# Altium schematic sheet FPGA_NonIO.SchDoc: User FPGA Pwr and Programming
size A3; Organization: Altium Limited.; Address1: Level 3, 12a Rodborough Rd; Address2: Frenchs Forest 2086; Address3: NSW; Address4: AUSTRALIA; DocumentNumber: 8; SheetNumber: 9; SheetTotal: 78
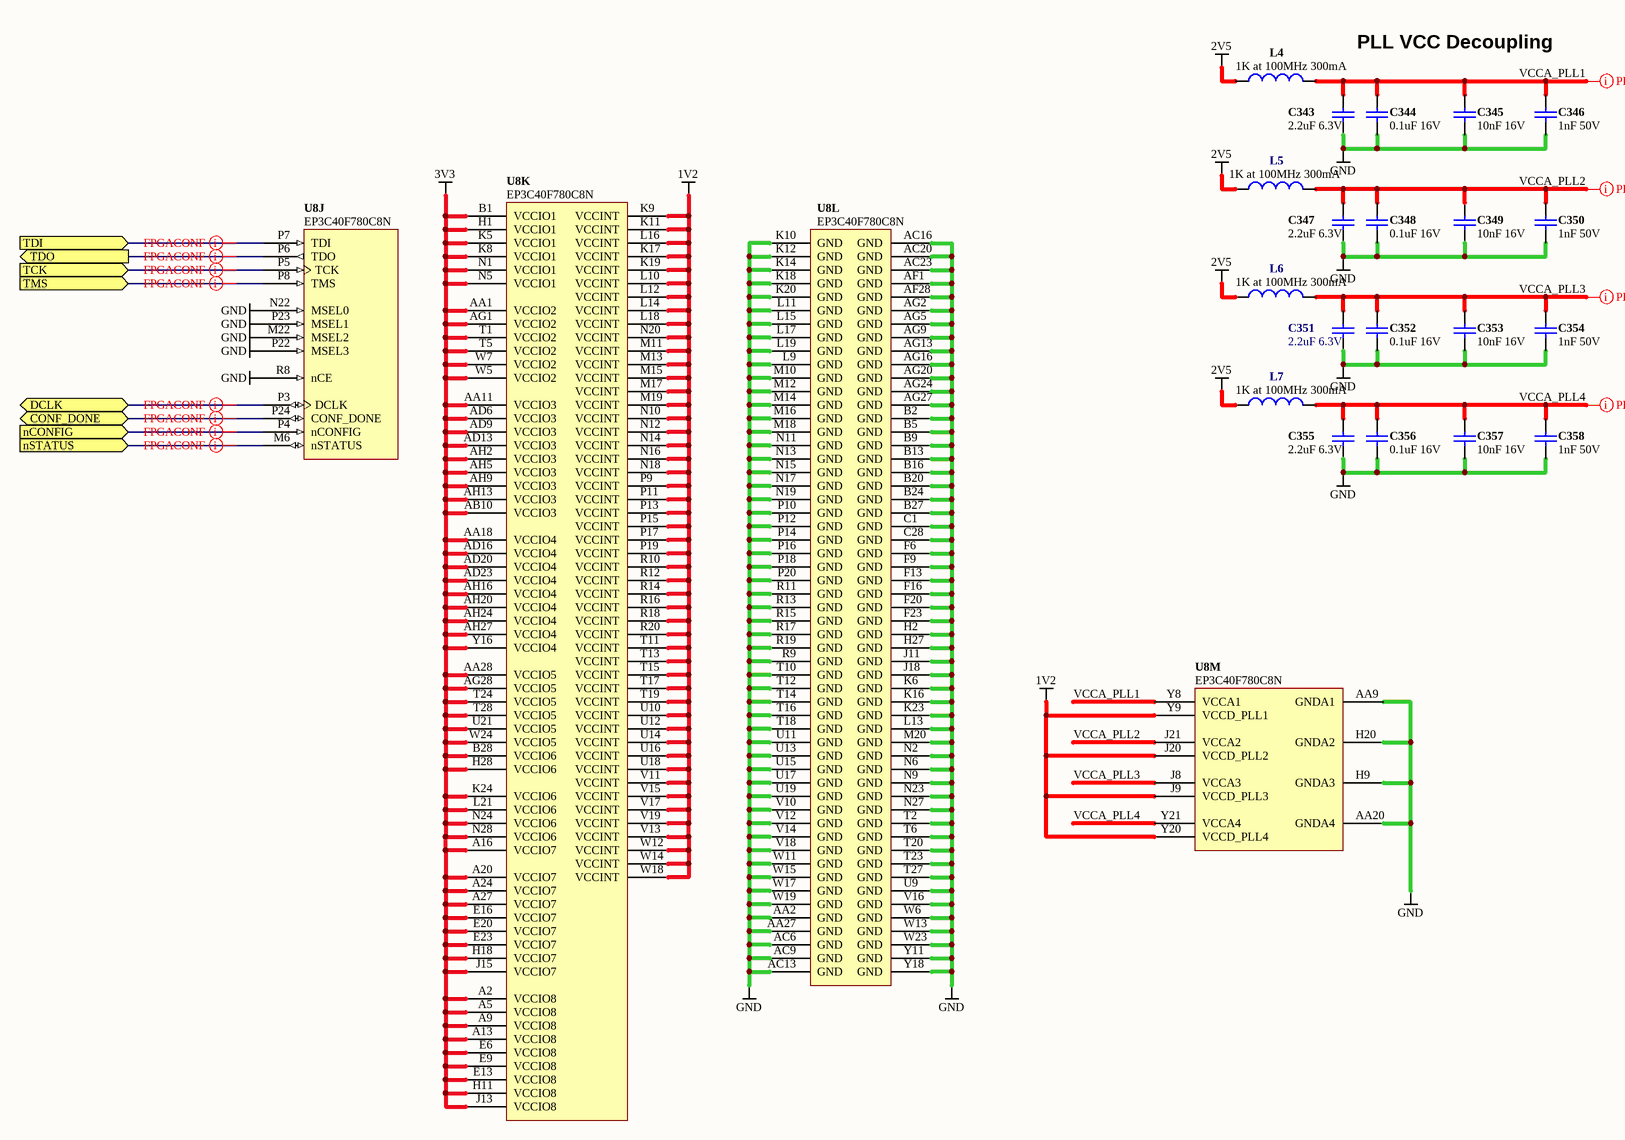
[diagram p0: FPGA_NonIO.SchDoc]

## Parts
C343  2.2uF 6.3V  [CAPC1005-STAR]
C344  0.1uF 16V  [CAPC1005-STAR]
C345  10nF 16V  [CAPC1005-STAR]
C346  1nF 50V  [CAPC1005-STAR]
C347  2.2uF 6.3V  [CAPC1005-STAR]
C348  0.1uF 16V  [CAPC1005-STAR]
C349  10nF 16V  [CAPC1005-STAR]
C350  1nF 50V  [CAPC1005-STAR]
C351  2.2uF 6.3V  [CAPC1005-STAR]
C352  0.1uF 16V  [CAPC1005-STAR]
C353  10nF 16V  [CAPC1005-STAR]
C354  1nF 50V  [CAPC1005-STAR]
C355  2.2uF 6.3V  [CAPC1005-STAR]
C356  0.1uF 16V  [CAPC1005-STAR]
C357  10nF 16V  [CAPC1005-STAR]
C358  1nF 50V  [CAPC1005-STAR]
L4  1K at 100MHz 300mA  [INDC1005]
L5  1K at 100MHz 300mA  [INDC1005]
L6  1K at 100MHz 300mA  [INDC1005]
L7  1K at 100MHz 300mA  [INDC1005]
U8  EP3C40F780C8N  [FBGA780-2]  (parts J,K,L,M of 13)

## Ports
CONF_DONE (bidir), DCLK (bidir), nCONFIG (in), nSTATUS (in), TCK (in), TDI (in), TDO (out), TMS (in)

## Nets
1V2: U8.J9(VCCD_PLL3) U8.J20(VCCD_PLL2) U8.K9(VCCINT) U8.K11(VCCINT) U8.K17(VCCINT) U8.K19(VCCINT) U8.L10(VCCINT) U8.L12(VCCINT) U8.L14(VCCINT) U8.L16(VCCINT) U8.L18(VCCINT) U8.M11(VCCINT) U8.M13(VCCINT) U8.M15(VCCINT) U8.M17(VCCINT) U8.M19(VCCINT) U8.N10(VCCINT) U8.N12(VCCINT) U8.N14(VCCINT) U8.N16(VCCINT) U8.N18(VCCINT) U8.N20(VCCINT) U8.P9(VCCINT) U8.P11(VCCINT) U8.P13(VCCINT) U8.P15(VCCINT) U8.P17(VCCINT) U8.P19(VCCINT) U8.R10(VCCINT) U8.R12(VCCINT) U8.R14(VCCINT) U8.R16(VCCINT) U8.R18(VCCINT) U8.R20(VCCINT) U8.T11(VCCINT) U8.T13(VCCINT) U8.T15(VCCINT) U8.T17(VCCINT) U8.T19(VCCINT) U8.U10(VCCINT) U8.U12(VCCINT) U8.U14(VCCINT) U8.U16(VCCINT) U8.U18(VCCINT) U8.V11(VCCINT) U8.V13(VCCINT) U8.V15(VCCINT) U8.V17(VCCINT) U8.V19(VCCINT) U8.W12(VCCINT) U8.W14(VCCINT) U8.W18(VCCINT) U8.Y9(VCCD_PLL1) U8.Y20(VCCD_PLL4)
2V5: L4.1 L5.1 L6.1 L7.1
3V3: U8.A2(VCCIO8) U8.A5(VCCIO8) U8.A9(VCCIO8) U8.A13(VCCIO8) U8.A16(VCCIO7) U8.A20(VCCIO7) U8.A24(VCCIO7) U8.A27(VCCIO7) U8.AA1(VCCIO2) U8.AA11(VCCIO3) U8.AA18(VCCIO4) U8.AA28(VCCIO5) U8.AB10(VCCIO3) U8.AD6(VCCIO3) U8.AD9(VCCIO3) U8.AD13(VCCIO3) U8.AD16(VCCIO4) U8.AD20(VCCIO4) U8.AD23(VCCIO4) U8.AG1(VCCIO2) U8.AG28(VCCIO5) U8.AH2(VCCIO3) U8.AH5(VCCIO3) U8.AH9(VCCIO3) U8.AH13(VCCIO3) U8.AH16(VCCIO4) U8.AH20(VCCIO4) U8.AH24(VCCIO4) U8.AH27(VCCIO4) U8.B1(VCCIO1) U8.B28(VCCIO6) U8.E6(VCCIO8) U8.E9(VCCIO8) U8.E13(VCCIO8) U8.E16(VCCIO7) U8.E20(VCCIO7) U8.E23(VCCIO7) U8.H1(VCCIO1) U8.H11(VCCIO8) U8.H18(VCCIO7) U8.H28(VCCIO6) U8.J13(VCCIO8) U8.J15(VCCIO7) U8.K5(VCCIO1) U8.K8(VCCIO1) U8.K24(VCCIO6) U8.L21(VCCIO6) U8.N1(VCCIO1) U8.N5(VCCIO1) U8.N24(VCCIO6) U8.N28(VCCIO6) U8.T1(VCCIO2) U8.T5(VCCIO2) U8.T24(VCCIO5) U8.T28(VCCIO5) U8.U21(VCCIO5) U8.W5(VCCIO2) U8.W7(VCCIO2) U8.W24(VCCIO5) U8.Y16(VCCIO4)
GND: C343.2 C344.2 C345.2 C346.2 C347.2 C348.2 C349.2 C350.2 C351.2 C352.2 C353.2 C354.2 C355.2 C356.2 C357.2 C358.2 U8.AA2(GND) U8.AA9(GNDA1) U8.AA20(GNDA4) U8.AA27(GND) U8.AC6(GND) U8.AC9(GND) U8.AC13(GND) U8.AC16(GND) U8.AC20(GND) U8.AC23(GND) U8.AF1(GND) U8.AF28(GND) U8.AG2(GND) U8.AG5(GND) U8.AG9(GND) U8.AG13(GND) U8.AG16(GND) U8.AG20(GND) U8.AG24(GND) U8.AG27(GND) U8.B2(GND) U8.B5(GND) U8.B9(GND) U8.B13(GND) U8.B16(GND) U8.B20(GND) U8.B24(GND) U8.B27(GND) U8.C1(GND) U8.C28(GND) U8.F6(GND) U8.F9(GND) U8.F13(GND) U8.F16(GND) U8.F20(GND) U8.F23(GND) U8.H2(GND) U8.H9(GNDA3) U8.H20(GNDA2) U8.H27(GND) U8.J11(GND) U8.J18(GND) U8.K6(GND) U8.K10(GND) U8.K12(GND) U8.K14(GND) U8.K16(GND) U8.K18(GND) U8.K20(GND) U8.K23(GND) U8.L9(GND) U8.L11(GND) U8.L13(GND) U8.L15(GND) U8.L17(GND) U8.L19(GND) U8.M10(GND) U8.M12(GND) U8.M14(GND) U8.M16(GND) U8.M18(GND) U8.M20(GND) U8.M22(MSEL2) U8.N2(GND) U8.N6(GND) U8.N9(GND) U8.N11(GND) U8.N13(GND) U8.N15(GND) U8.N17(GND) U8.N19(GND) U8.N22(MSEL0) U8.N23(GND) U8.N27(GND) U8.P10(GND) U8.P12(GND) U8.P14(GND) U8.P16(GND) U8.P18(GND) U8.P20(GND) U8.P22(MSEL3) U8.P23(MSEL1) U8.R8(nCE) U8.R9(GND) U8.R11(GND) U8.R13(GND) U8.R15(GND) U8.R17(GND) U8.R19(GND) U8.T2(GND) U8.T6(GND) U8.T10(GND) U8.T12(GND) U8.T14(GND) U8.T16(GND) U8.T18(GND) U8.T20(GND) U8.T23(GND) U8.T27(GND) U8.U9(GND) U8.U11(GND) U8.U13(GND) U8.U15(GND) U8.U17(GND) U8.U19(GND) U8.V10(GND) U8.V12(GND) U8.V14(GND) U8.V16(GND) U8.V18(GND) U8.W6(GND) U8.W11(GND) U8.W13(GND) U8.W15(GND) U8.W17(GND) U8.W19(GND) U8.W23(GND) U8.Y11(GND) U8.Y18(GND)
CONF_DONE: U8.P24(CONF_DONE) ; port CONF_DONE
DCLK: U8.P3(DCLK) ; port DCLK
nCONFIG: U8.P4(nCONFIG) ; port nCONFIG
nSTATUS: U8.M6(nSTATUS) ; port nSTATUS
TCK: U8.P5(TCK) ; port TCK
TDI: U8.P7(TDI) ; port TDI
TDO: U8.P6(TDO) ; port TDO
TMS: U8.P8(TMS) ; port TMS
VCCA_PLL1: C343.1 C344.1 C345.1 C346.1 L4.2 U8.Y8(VCCA1)
VCCA_PLL2: C347.1 C348.1 C349.1 C350.1 L5.2 U8.J21(VCCA2)
VCCA_PLL3: C351.1 C352.1 C353.1 C354.1 L6.2 U8.J8(VCCA3)
VCCA_PLL4: C355.1 C356.1 C357.1 C358.1 L7.2 U8.Y21(VCCA4)

## Layout directives
net class FPGACONF: CONF_DONE, DCLK, nCONFIG, nSTATUS, TCK, TDI, TDO, TMS
net class PLL: VCCA_PLL1, VCCA_PLL2, VCCA_PLL3, VCCA_PLL4

## Notes on the sheet
- PLL VCC Decoupling
- Sheet Title
- Project Title
- Size:
- Date:
- A3
- Assy:
- Time:
- Revision:
- Sheet
- of
- File:

## Library data of the parts
C343 C347 C351 C355 = D-101-0112: Capacitor, Ceramic, 2.2uF 10% 6.3V 0402 (1005) X5R; Polarity: Non-Polarized; Tolerance: 20 %; Capacitance: 2.2 uF; Dielectric: X5R; Mounting Technology: Surface Mount; Rated Voltage: 6.3 V; Status: Unreleased; Technology: None; Category: Capacitor
C344 C348 C352 C356 = D-101-0080: Capacitor, Ceramic, 0.1uF 10% 16V 0402 (1005) X7R; Polarity: Non-Polarized; Capacitance: 0.1 uF; Dielectric: X7R; Mounting Technology: Surface Mount; Rated Voltage: 16 V; Status: Production; Technology: Ceramic; Tolerance: 10 %; Category: Capacitor
C345 C349 C353 C357 = D-101-0077: Capacitor, Ceramic, 10nF 10% 16V 0402 (1005) X7R; Polarity: Non-Polarized; Capacitance: 10 nF; Dielectric: X7R; Mounting Technology: Surface Mount; Rated Voltage: 16 V; Status: Production; Technology: Ceramic; Tolerance: 10 %; Category: Capacitor
C346 C350 C354 C358 = D-101-0030: Capacitor, Ceramic, 1nF 10% 50V 0402 (1005) X7R; Polarity: Non-Polarized; Capacitance: 1 nF; Dielectric: X7R; Mounting Technology: Surface Mount; Rated Voltage: 50 V; Status: Production; Technology: Ceramic; Tolerance: 10 %; Category: Capacitor
L4-L7 = D-102-0026: Inductor, Ferrite Bead 1K@100MHz 300mA 0402 BK1005HS102-T; Inductance: nH; Max Input Current: 300 mA; Mounting Technology: Surface Mount; Status: Production; Category: Inductor
U8 = D-241-0023: FPGA, Altera Cyclone3-40 F780; Supply Voltage: mV; Mounting Technology: Surface Mount; Status: Unreleased; Technology: None; Category: IC-FPGA